# EAGLE schematic K-1 (EAGLE 9.4.2)
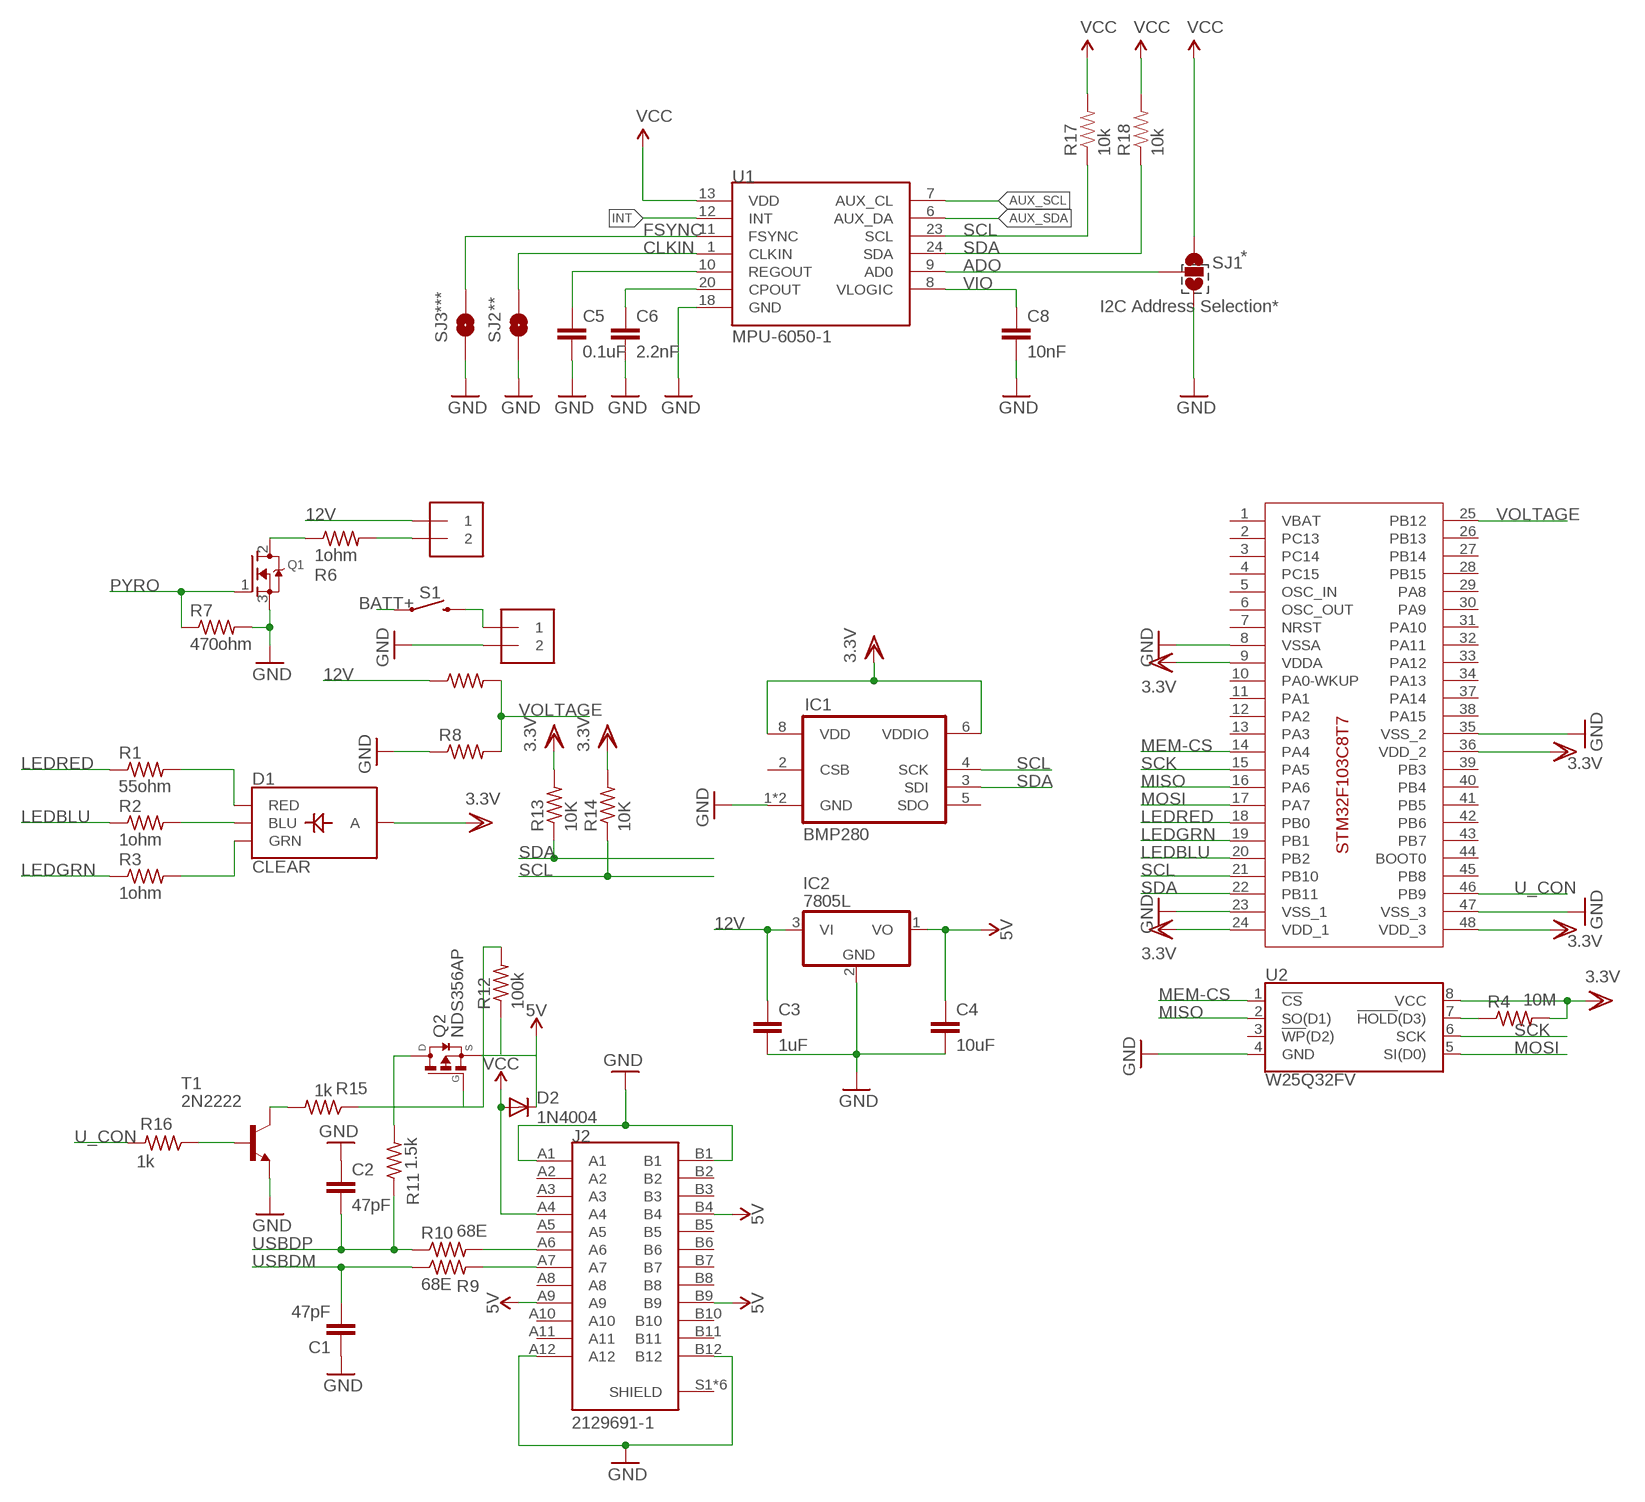
[diagram p0: schematic, sheet 1]

## Parts
C1  47pF  C2,5-3  [C2.5-3]
C2  47pF  C2,5-3  [C2.5-3]
C3  1uF  C2,5-3  [C2.5-3]
C4  10uF  C2,5-3  [C2.5-3]
C5  0.1uF  CAP0603-CAP  [0603-CAP]
C6  2.2nF  CAP0603-CAP  [0603-CAP]
C8  10nF  CAP0603-CAP  [0603-CAP]
D1  CLEAR  LED-RGB-CACLEAR  [LED-RGB-THRU]
D2  1N4004  [DO41-10]
IC1  BMP280  [BMP280]
IC2  7805L  [TO92]
J1  1X2-3.5MM  [1X2-3.5MM]
J2  2129691-1  [TE_2129691-1]
J6  1X2-3.5MM  [1X2-3.5MM]
Q1  MOSFET-NGDS_TO220V  [TO220V]
Q2  NDS356AP  [SSOT-3]
R1  55ohm  R-US_0204/2V  [0204V]
R2  1ohm  R-US_0204/2V  [0204V]
R3  1ohm  R-US_0204/2V  [0204V]
R4  10M  R-US_0204/2V  [0204V]
R5  R-US_0204/2V  [0204V]
R6  1ohm  R-US_0204/2V  [0204V]
R7  470ohm  R-US_0204/2V  [0204V]
R8  R-US_0204/2V  [0204V]
R9  68E  R-US_0204/2V  [0204V]
R10  68E  R-US_0204/2V  [0204V]
R11  1.5k  R-US_0204/2V  [0204V]
R12  100k  R-US_0204/2V  [0204V]
R13  10K  R-US_0204/2V  [0204V]
R14  10K  R-US_0204/2V  [0204V]
R15  1k  R-US_0204/2V  [0204V]
R16  1k  R-US_0204/2V  [0204V]
R17  10k  RESISTOR0603-RES  [0603-RES]
R18  10k  RESISTOR0603-RES  [0603-RES]
S1  MOMENTARY-SWITCH-SPST-SMD-5.2-REDUNDANT  [TACTILE_SWITCH_SMD_5.2MM]
SJ1  SOLDERJUMPER_2WAYPASTE2&3  [SJ_3_PASTE2&3]
SJ2  SOLDERJUMPERTRACE  [SJ_2S-TRACE]
SJ3  SOLDERJUMPERTRACE  [SJ_2S-TRACE]
T1  2N2222  [TO92-EBC-OVAL]
U1  MPU-6050-1  [QFN-24-4MM2]
U2  W25Q32FV  W25Q32FVSS  [SOIC-8]
U$1  STM32F103C8T7  [STM32F103C8T7]

## Nets
5V: C4.1 D2.C IC2.1(VO) J2.A9 J2.B4 J2.B9 Q2.2(S)
12V: C3.1 IC2.3(VI) J6.1 R5.1
ADO: SJ1.2 U1.9(AD0)
AUX_SCL: U1.7(AUX_CL)
AUX_SDA: U1.6(AUX_DA)
BATT+: S1.1 S1.2
CLKIN: SJ2.2 U1.1(CLKIN)
FSYNC: SJ3.2 U1.11(FSYNC)
GND: C1.1 C2.1 C3.2 C4.2 C5.2 C6.2 C8.2 IC1.1(GND) IC1.7(GND) IC2.2(GND) J1.2 J2.A1 J2.A12 J2.B1 J2.B12 Q1.3(S) R7.2 R8.1 SJ1.3 SJ2.1 SJ3.1 T1.E U1.18(GND) U2.4(GND) U$1.8(VSSA) U$1.23(VSS_1) U$1.35(VSS_2) U$1.47(VSS_3)
INT: U1.12(INT)
LEDBLU: R2.1 U$1.20(PB2)
LEDGRN: R3.1 U$1.19(PB1)
LEDRED: R1.1 U$1.18(PB0)
MEM-CS: U2.1(!CS!) U$1.14(PA4)
MISO: U2.2(SO(D1)) U$1.16(PA6)
MOSI: U2.5(SI(D0)) U$1.17(PA7)
N$1: D1.1(RED) R1.2
N$2: D1.3(GRN) R3.2
N$3: D1.4(BLU) R2.2
N$4: J6.2 R6.2
N$5: R4.1 U2.7(!HOLD!(D3))
N$6: Q1.2(D) R6.1
N$7: J2.A6 R10.2
N$8: Q2.3(D) R11.2
N$9: R12.1
N$10: Q2.1(G) R12.2 R15.1
N$11: C6.1 U1.20(CPOUT)
N$12: C5.1 U1.10(REGOUT)
N$13: R15.2 T1.C
N$14: R16.1 T1.B
N$15: J1.1 S1.3 S1.4
N$16: J2.A7 R9.2
PYRO: Q1.1(G) R7.1
SCK: U2.6(SCK) U$1.15(PA5)
SCL: IC1.4(SCK) R14.1 R17.1 U1.23(SCL) U$1.21(PB10)
SDA: IC1.3(SDI) R13.1 R18.1 U1.24(SDA) U$1.22(PB11)
U_CON: R16.2 U$1.46(PB9)
USBDM: C1.2 R9.1
USBDP: C2.2 R10.1 R11.1
VCC: D2.A J2.A4 R17.2 R18.2 SJ1.1 U1.13(VDD)
VDD: D1.2(A) IC1.6(VDDIO) IC1.8(VDD) R4.2 R13.2 R14.2 U2.8(VCC) U$1.9(VDDA) U$1.24(VDD_1) U$1.36(VDD_2) U$1.48(VDD_3) ; supply symbol labelled 3.3V
VIO: C8.1 U1.8(VLOGIC)
VOLTAGE: R5.2 R8.2 U$1.25(PB12)
Unconnected: IC1.2(CSB) IC1.5(SDO) J2.A2 J2.A3 J2.A5 J2.A8 J2.A10 J2.A11 J2.B2 J2.B3 J2.B5 J2.B6 J2.B7 J2.B8 J2.B10 J2.B11 J2.S1(SHIELD) J2.S2(SHIELD) J2.S3(SHIELD) J2.S4(SHIELD) J2.S5(SHIELD) J2.S6(SHIELD) U2.3(!WP!(D2)) U$1.1(VBAT) U$1.2(PC13) U$1.3(PC14) U$1.4(PC15) U$1.5(OSC_IN) U$1.6(OSC_OUT) U$1.7(NRST) U$1.10(PA0-WKUP) U$1.11(PA1) U$1.12(PA2) U$1.13(PA3) U$1.26(PB13) U$1.27(PB14) U$1.28(PB15) U$1.29(PA8) U$1.30(PA9) U$1.31(PA10) U$1.32(PA11) U$1.33(PA12) U$1.34(PA13) U$1.37(PA14) U$1.38(PA15) U$1.39(PB3) U$1.40(PB4) U$1.41(PB5) U$1.42(PB6) U$1.43(PB7) U$1.44(BOOT0) U$1.45(PB8)

## Notes on the sheet
- *
- *** | ** | I2C Address Selection*

## Library data of the parts
C1-C4 = capacitor-wima:C: CAPACITOR naming: grid - package width
C5 C6 C8 = SparkFun:CAP: Capacitor Standard 0603 ceramic capacitor, and 0.1" leaded capacitor.
D1 = SparkFun-LED:LED-RGB-CA: LED-RGB Diffused Common Anode Packages: LED RGB-THRU P-LCC-4-3 LED-TRICOLOR-SMD SparkFun Products: RGB Diffused Common Anode- Diffuse <[https://www.sparkfun.com/products/10821]> RGB Diffused Common Anode - Clear <[https://www.sparkfun.com/products/10820]> Qduino Mini <[https://www.sparkfun.com/products/13614]> Triple Output LED RGB - SMD <https://www.sparkfun.com/products/7844>; PROD_ID: DIO-10631
D2 = adafruit:1N4004: DIODE General purpose 1N400x type rectifier (With bigger pads) http://www.ladyada.net/library/pcb/eaglelibrary.html
IC1 = bosch-bmp280:BMP280: The BMP280 is an absolute barometric pressure sensor especially designed for mobile applications. The sensor module is housed in an extremely compact 8-pin metal-lid LGA package with a footprint of only 2.0 × 2.5 mm2 and 0.95 mm package height. Its small dimensions and its low power consumption of 2.7 μA @1Hz allow the implementation in battery driven devices such as mobile phones, GPS modules or watches. The library has been designed by Richard Magdycz <https://www.facebook.com/groups/eaglecadsoftUK>
IC2 = adafruit:78*: Positive VOLTAGE REGULATOR Added bigger pads to the TO-92 package
J1 J6 = adafruit:1X2: 3.5mm Terminal block http://www.ladyada.net/library/pcb/eaglelibrary.html
J2 = typeC:2129691-1: Conn USB 3.1 Type C RCP 24 POS Solder RA SMD 24 Terminal 1 Port T/R; AVAILABILITY: Unavailable; CENTERLINE_PITCH: .5 mm[.019 in]; COMMENT: 2129691-1; DESCRIPTION: USB3.1 TYPE-C REC MID-MOUNT 0.485 HYBRID; MF: TE Connectivity; MP: 2129691-1; NUMBER_OF_POSITIONS: 24; PACKAGE: None; PRICE: None; PRODUCT_TYPE: Connector; TE_PURCHASE_URL: https://www.te.com/usa-en/product-2129691-1.html?te_bu=Cor&te_type=disp&te_campaign=seda_glo_cor-seda-global-disp-prtnr-fy19-seda-model-bom-cta_sma-317_1&elqCampaignId=32493
Q1 = adafruit:MOSFET-N: N-Channel Mosfet 2N7002E - 60V 260mA SOT23 [Digikey: 2N7002ET1GOSTR-ND] - REEL BSH103 - 30V 850mA SOT23 [Digikey: 568-5013-1-ND]
Q2 = NDS356AP:NDS356AP: P-Channel Logic Level Enhancement Mode Field Effect Transistor; AVAILABILITY: Unavailable; DESCRIPTION: P-Channel 30 V 0.3 Ohm SMT Enhance Mode Field Effect Transistor - SSOT-3; MF: ON Semiconductor; MP: NDS356AP; PACKAGE: SC-59 ON Semiconductor; PRICE: None
R1-R12 R15 R16 = adafruit:R-US_: RESISTOR, American symbol
R13 R14 = rcl:R-US_: RESISTOR, American symbol; SPICEPREFIX: R
R17 R18 = SparkFun:RESISTOR: Resistor Basic schematic elements and footprints for 0603, 1206, and PTH resistors.
S1 = SparkFun-Switches:MOMENTARY-SWITCH-SPST: Momentary Switch (Pushbutton) - SPST Normally-open (NO) SPST momentary switches (buttons, pushbuttons). Variants PTH-12MM - 12mm square, through-hole Momentary Pushbutton Switch - 12mm Square <https://www.sparkfun.com/products/9190> (COM-09190) PTH-6.0MM, PTH-6.0MM-KIT - 6.0mm square, through-hole Mini Pushbutton Switch <https://www.sparkfun.com/products/97> (COM-00097) KIT package intended for soldering kit's - only one side of pads' copper is exposed. PTH-RIGHT-ANGLE-KIT - Right-angle, through-hole Right Angle Tactile Button <https://www.sparkfun.com/products/10791> - Used on SparkFun BigTime Watch Kit <https://www.sparkfun.com/products/11734> SMD-12MM - 12mm square, surface-mount Tactile Button - SMD (12mm) <https://www.sparkfun.com/products/12993> (COM-12993) Used on SparkFun PicoBoard <https://www.sparkfun.com/products/11888> SMD-4.5MM - 4.5mm Square Trackball Switch Used on SparkFun Blackberry Trackballer Breakout <https://www.sparkfun.com/products/13169> SMD-4.6MMX2.8MM - 4.60mm x 2.80mm, surface mount Used on SparkFun SAMD21 Mini Breakout <https://www.sparkfun.com/products/13664> SMD-5.2MM, SMD-5.2-REDUNDANT - 5.2mm square, surface-mount Mini Pushbutton Switch - SMD <https://www.sparkfun.com/products/8720> (COM-08720) Used on Arduino Pro Mini <https://www.sparkfun.com/products/11114> REDUNDANT package connects both switch circuits together SMD-6.0X3.5MM - 6.0 x 3.5mm, surface mount Momentary Reset Switch SMD <https://www.sparkfun.com/products/8229> (COM-08229) SMD-6.2MM-TALL - 6.2mm square, surface mount Tactile Button - SMD (6mm) <https://www.sparkfun.com/products/12992> Used on SparkFun Digital Sandbox <https://www.sparkfun.com/products/12651> SMD-RIGHT-ANGLE - Right-angle, surface mount Used on SparkFun Block for Intel® Edison - Arduino <https://www.sparkfun.com/products/13036>; PROD_ID: SWCH-08247; SF_SKU: COM-08720
SJ1 = SparkFun:SOLDERJUMPER_2WAY: Solder Jumper 2 way solder jumper
SJ2 SJ3 = SparkFun:SOLDERJUMPER: Solder Jumper Standard SMD solder jumper. Used to automate production. Two varients : Normally Open and Normally Closed are the same, but have different paste layers. NC will have a large amount of paste and should jumper during reflow.
T1 = adafruit:2N2222: NPN TRANSISTOR Big oval pads
U1 = Testing:MPU-6050
U2 = SparkFun-IC-Memory:W25Q32FV: W25Q32FV 32Mb (4MB) Serial Flash Memory The W25Q32FV support the standard Serial Peripheral Interface (SPI), Dual/Quad I/O SPI as well as 2-clocks instruction cycle Quad Peripheral Interface (QPI). 104MHz, SPI, 8-SOIC-EIAJ Datasheet <http://www.winbond.com/resource-files/w25q32fv%20revh%20091613.pdf> SparkFun Products SparkFun Blynk Board - ESP8266 <https://www.sparkfun.com/products/13794> (WRL-13794); PROD_ID: IC-13229
U$1 = STM32F103C8T7:STM32F103C8T7: STM32F103C8T7 ARM 32-BIT 72Hz 64KB MCU

## Net classes
0 Default: width 0.203 mm